# EAGLE design választó (EAGLE 6.5.0)
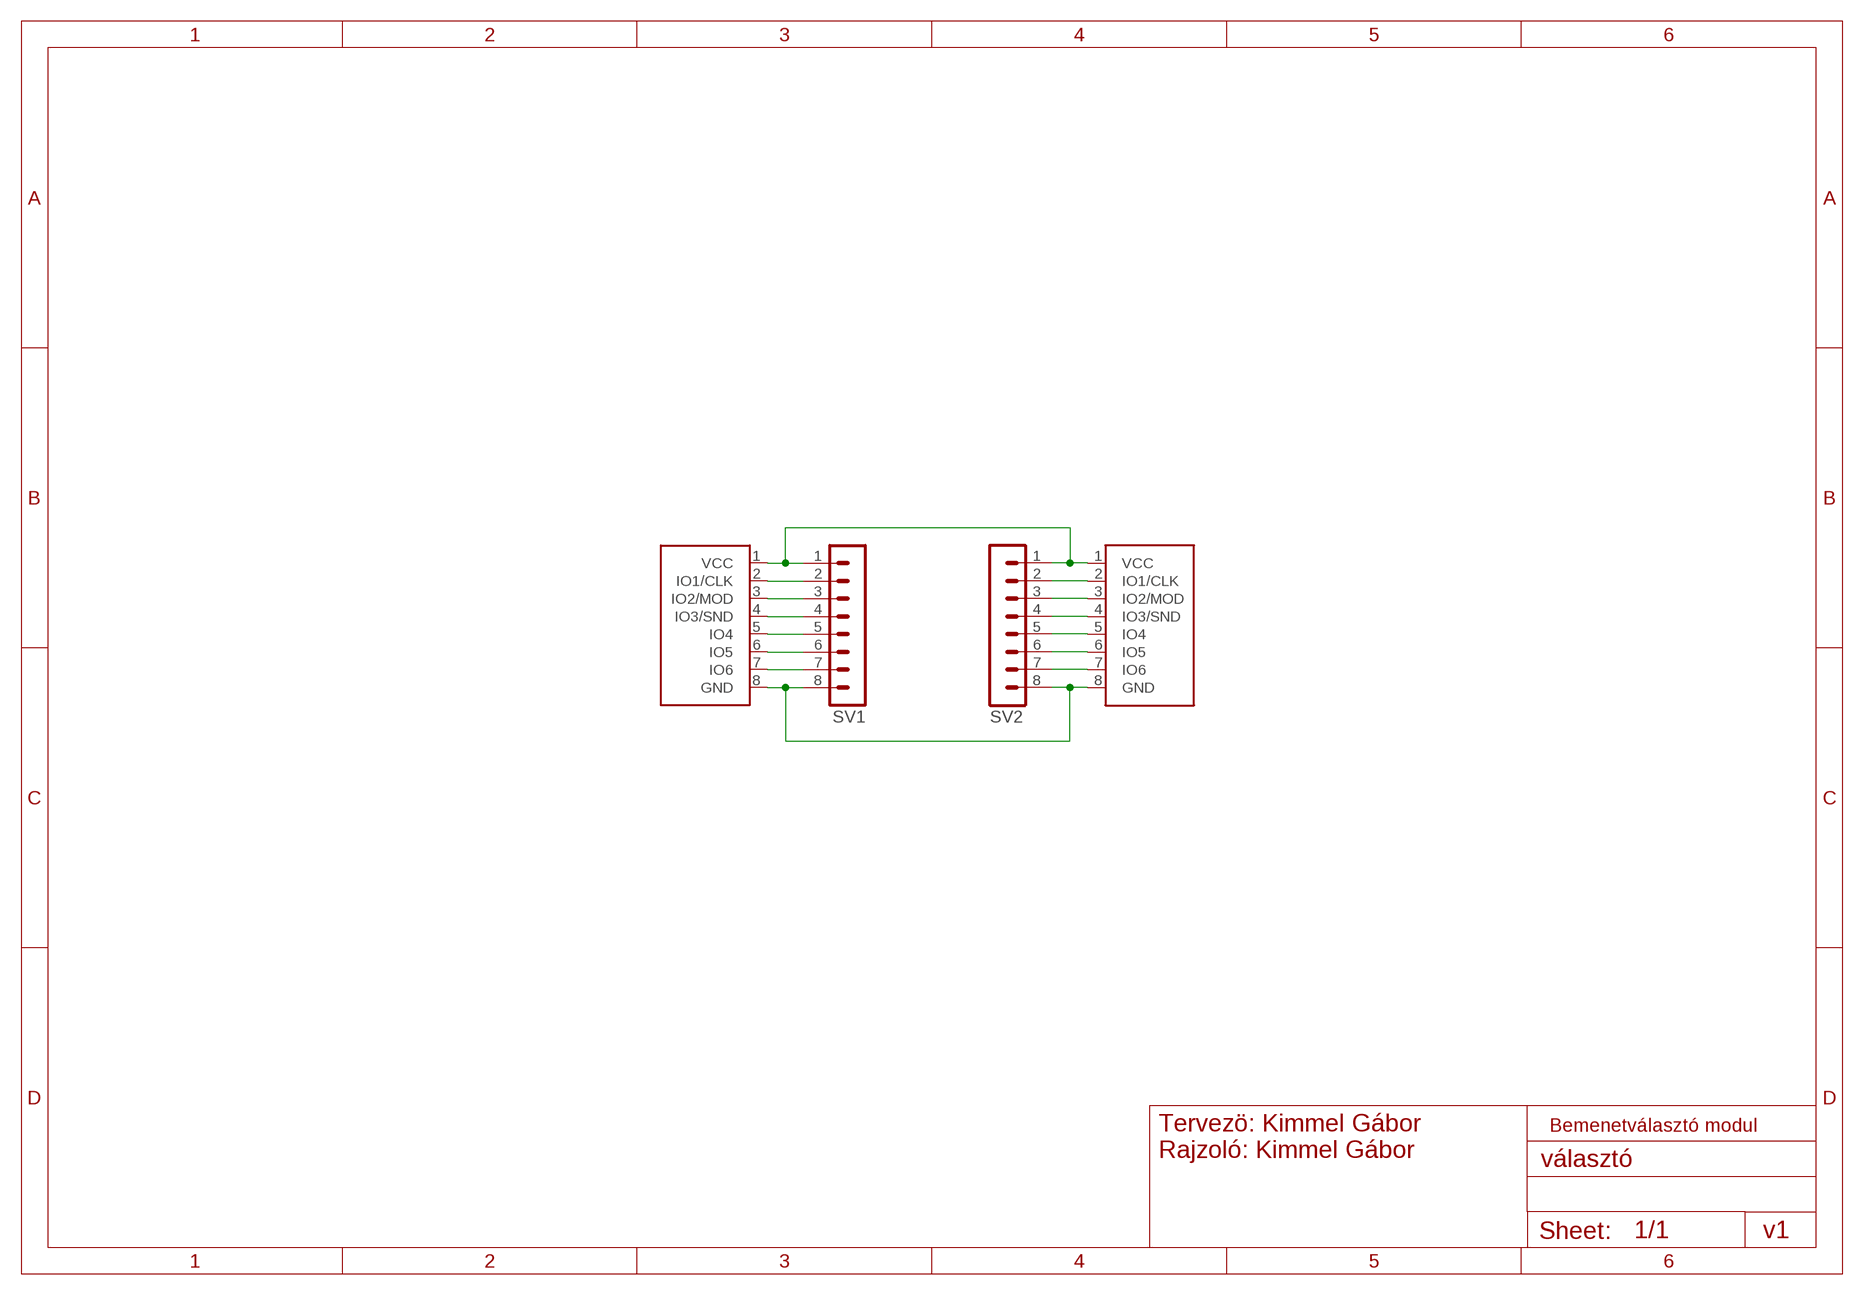
[diagram p0: schematic, sheet 1]

## Parts
SV1  MA08-1  [MA08-1]
SV2  MA08-1  [MA08-1]
U$1  GANZ-CONNECTOR  [FE08W]
U$2  GANZ-CONNECTOR-OUT  [MA08-1W]

## Nets
N$1: SV1.1 SV2.1 U$1.1(VCC) U$2.1(VCC)
N$2: SV1.2 U$1.2(IO1/CLK)
N$3: SV1.3 U$1.3(IO2/MOD)
N$4: SV1.4 U$1.4(IO3/SND)
N$5: SV1.5 U$1.5(IO4)
N$6: SV1.6 U$1.6(IO5)
N$7: SV1.7 U$1.7(IO6)
N$8: SV1.8 SV2.8 U$1.8(GND) U$2.8(GND)
N$10: SV2.2 U$2.2(IO1/CLK)
N$11: SV2.3 U$2.3(IO2/MOD)
N$12: SV2.4 U$2.4(IO3/SND)
N$13: SV2.5 U$2.5(IO4)
N$14: SV2.6 U$2.6(IO5)
N$15: SV2.7 U$2.7(IO6)

## Notes on the sheet
- Tervezö: Kimmel Gábor
  Rajzoló: Kimmel Gábor
- Bemenetválasztó modul
- v1

## Library data of the parts
SV1 SV2 = con-lstb:MA08-1: PIN HEADER; OC_FARNELL: unknown; OC_NEWARK: unknown
U$1 = ganzlib:GANZ-CONNECTOR
U$2 = ganzlib:GANZ-CONNECTOR-OUT

## Board
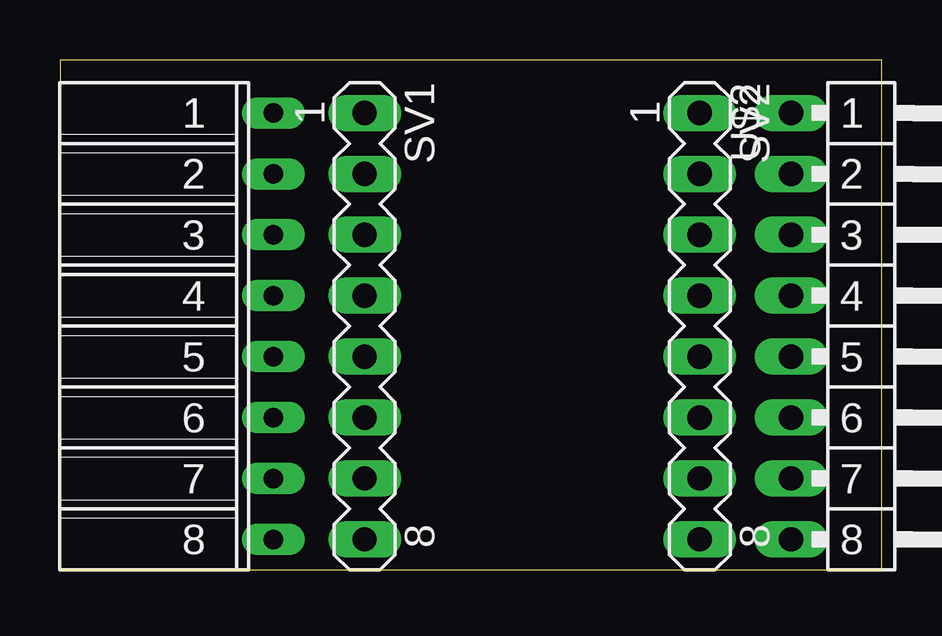
[diagram p1: board, top side]
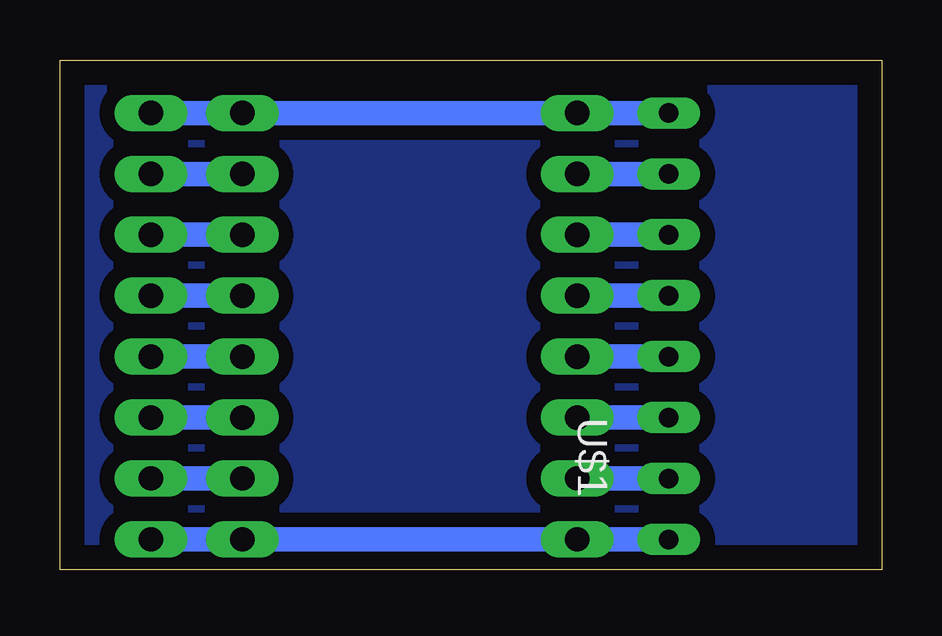
[diagram p2: board, bottom side, seen from below]

Size 34.27 x 21.26 mm. Coordinates in mm from the lower left corner, seen from the top.
Outline: 0,0 34.27,0 34.27,21.26 0,21.26 0,0
Copper layers (1*16): Top 0.035mm / dielectric 1.5mm / Bottom 0.035mm
Design rules "default": minimum track width 10mil, minimum drill 24mil, track to track 8mil, track to pad 8mil, pad to pad 8mil, via to via 8mil, smd to smd 8mil, copper to edge 40mil, drill to drill 8mil, minimum pad ring 10mil, minimum via ring 8mil, stop-mask expansion 4mil, vias tented up to drill 0mil, thermal gap 10mil

### Footprints (pad centres in the part's own frame; a part is rotated, then mirrored left to right if it is on the bottom)
MA08-1 = drill 1.016 long: 1 -8.89,0; 2 -6.35,0; 3 -3.81,0; 4 -1.27,0; 5 1.27,0; 6 3.81,0; 7 6.35,0; 8 8.89,0
FE08W = drill 0.813 long: 1 5.08,8.89; 2 5.08,6.35; 3 5.08,3.81; 4 5.08,1.27; 5 5.08,-1.27; 6 5.08,-3.81; 7 5.08,-6.35; 8 5.08,-8.89
MA08-1W = drill 1.016 long: 1 0,8.89; 2 0,6.35; 3 0,3.81; 4 0,1.27; 5 0,-1.27; 6 0,-3.81; 7 0,-6.35; 8 0,-8.89

### Placement (x,y rotation side)
SV1  12.7,10.16 270 top
SV2  26.67,10.16 270 top
U$1  3.81,10.16 0 top
U$2  30.48,10.16 0 top

### Tracks (layer width: path | path; a pad name or v marks a point on that pad's centre or on a via)
GND
  pour Bottom (isolate 0.61): 0,21.59 34.29,21.59 34.29,0 0,0
N$1
  Bottom 1.016: U$1.1 SV2.1 SV1.1 U$2.1
N$2
  Bottom 1.016: U$1.2 SV1.2
N$3
  Bottom 1.016: U$1.3 SV1.3
N$4
  Bottom 1.016: U$1.4 SV1.4
N$5
  Bottom 1.016: SV1.5 U$1.5
N$6
  Bottom 1.016: U$1.6 SV1.6
N$7
  Bottom 1.016: SV1.7 U$1.7
N$8
  Bottom 1.016: U$1.8 SV1.8 SV2.8 U$2.8
N$10
  Bottom 1.016: U$2.2 SV2.2
N$11
  Bottom 1.016: U$2.3 SV2.3
N$12
  Bottom 1.016: U$2.4 SV2.4
N$13
  Bottom 1.016: U$2.5 SV2.5
N$14
  Bottom 1.016: U$2.6 SV2.6
N$15
  Bottom 1.016: U$2.7 SV2.7